# Altium schematic sheet Magneto.SchDoc
size A4; SheetNumber: 4; SheetTotal: 6
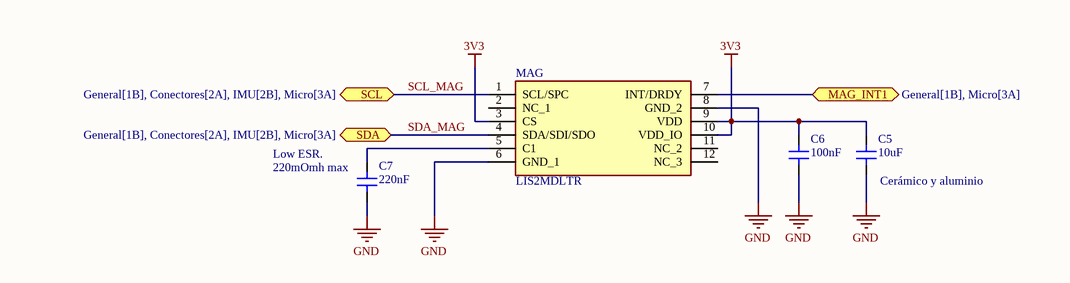
[diagram p0: Magneto.SchDoc]

## Parts
C5  Valor: 10uF  [CAP SMD 0805]  (hidden comment: CAP_0805_100nF)
C6  Valor: 100nF  [CAP SMD 0805]  (hidden comment: CAP_0805_100nF)
C7  Valor: 220nF  [CAP SMD 0805]  (hidden comment: CAP_0805_100nF)
MAG  LIS2MDLTR  [LGA-12]

## Ports
MAG_INT1 (bidir, see General[1B], Micro[3A]), SCL (bidir, see General[1B], Conectores[2A], IMU[2B], Micro[3A]), SDA (bidir, see General[1B], Conectores[2A], IMU[2B], Micro[3A])

## Nets
3V3: C5.2 C6.2 MAG.3(CS) MAG.9(VDD) MAG.10(VDD_IO)
GND: C5.1 C6.1 C7.2 MAG.6(GND_1) MAG.8(GND_2)
MAG_INT1: MAG.7(INT/DRDY) ; port MAG_INT1
SCL_MAG: MAG.1(SCL/SPC) ; port SCL
SDA_MAG: MAG.4(SDA/SDI/SDO) ; port SDA
NetC7_1: C7.1 MAG.5(C1)

Not connected (* = marked no-connect by the designer): MAG 2(NC_1) 11(NC_2) 12(NC_3)

## Notes on the sheet
- (near C7) Low ESR.
- (near C7) 220mOmh max
- (near C5) Cerámico y aluminio

## Library data of the parts
C5-C7 = CMP-067-0005-1: Condensador 0805 100nF; ComponentLink1URL: -; RefFabricante: -; ComponentLink2URL: -; Fabricante: -; ComponentLink2Description: Datasheet; Design Item ID: CAP_0805_100nF; ComponentLink1Description: Link-Compra; RefDistribuidor: -; Distribuidor: -; Source: BMS_Slave.SCHLIB
MAG = LIS2MDLTR: Integrated Circuit; Manufacturer_Name: STMicroelectronics; Datasheet Link: http://www.st.com/content/ccc/resource/technical/document/datasheet/group3/29/13/d1/e0/9a/4d/4f/30/DM00395193/files/DM00395193.pdf/jcr:content/translations/en.DM00395193.pdf; Manufacturer_Part_Number: LIS2MDLTR; Mouser Part Number: 511-LIS2MDLTR; Mouser Price/Stock: https://www.mouser.co.uk/ProductDetail/STMicroelectronics/LIS2MDLTR?qs=5aG0NVq1C4wS0n6b5NiBNQ%3D%3D; Arrow Part Number: LIS2MDLTR; Arrow Price/Stock: https://www.arrow.com/en/products/lis2mdltr/stmicroelectronics?region=nac